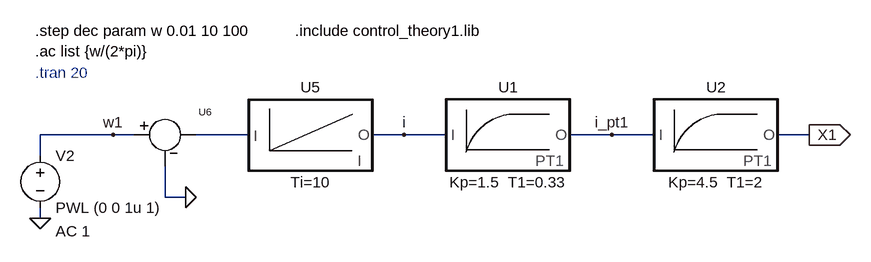
[diagram p0: schematic P_I_PT1_PT1a.asc]
P_I_PT1_PT1a.asc, the LTspice schematic file:
Version 4
SHEET 1 1768 680
WIRE 96 128 -16 128
WIRE 128 128 96 128
WIRE 304 128 224 128
WIRE 544 128 496 128
WIRE 608 128 544 128
WIRE 864 128 800 128
WIRE 928 128 864 128
WIRE 1168 128 1120 128
WIRE -16 160 -16 128
WIRE 176 224 176 176
WIRE 208 224 176 224
WIRE -16 256 -16 240
FLAG -16 256 0
FLAG 1168 128 X1
IOPIN 1168 128 Out
FLAG 96 128 w1
FLAG 544 128 i
FLAG 864 128 i_pt1
FLAG 208 224 0
SYMBOL voltage -16 144 R0
WINDOW 123 24 132 Left 0
WINDOW 39 0 0 Left 0
SYMATTR Value2 AC 1
SYMATTR InstName V2
SYMATTR Value PWL (0 0 1u 1)
SYMBOL ct___i 400 128 R0
SYMATTR InstName U5
SYMATTR Value Ti=10
SYMBOL ct___sub 176 128 R0
SYMATTR InstName U6
SYMBOL ct___pt1 704 128 R0
SYMATTR InstName U1
SYMATTR Value Kp=1.5  T1=0.33
SYMBOL ct___pt1 1024 128 R0
SYMATTR InstName U2
SYMATTR Value Kp=4.5  T1=2
TEXT -24 -32 Left 0 !.step dec param w 0.01 10 100\n.ac list {w/(2*pi)}
TEXT 376 -32 Left 0 !.include control_theory1.lib
TEXT -24 32 Left 0 ;.tran 20

The netlist it stands for:
* P_I_PT1_PT1a.asc
V2 w1 0 PWL (0 0 1u 1) AC 1
XU5 N001 i CT___I Ti=10  ; pins in out
XU6 w1 0 N001 CT___SUB  ; pins inp inm out
XU1 i i_pt1 CT___PT1 Kp=1.5  T1=0.33  ; pins in out
XU2 i_pt1 X1 CT___PT1 Kp=4.5  T1=2  ; pins in out
.step dec param w 0.01 10 100
.ac list {w/(2*pi)}
.include control_theory1.lib
* .tran 20
.backanno
.end